# Altium schematic sheet Main.SchDoc
size B; SheetNumber: 3; SheetTotal: 3
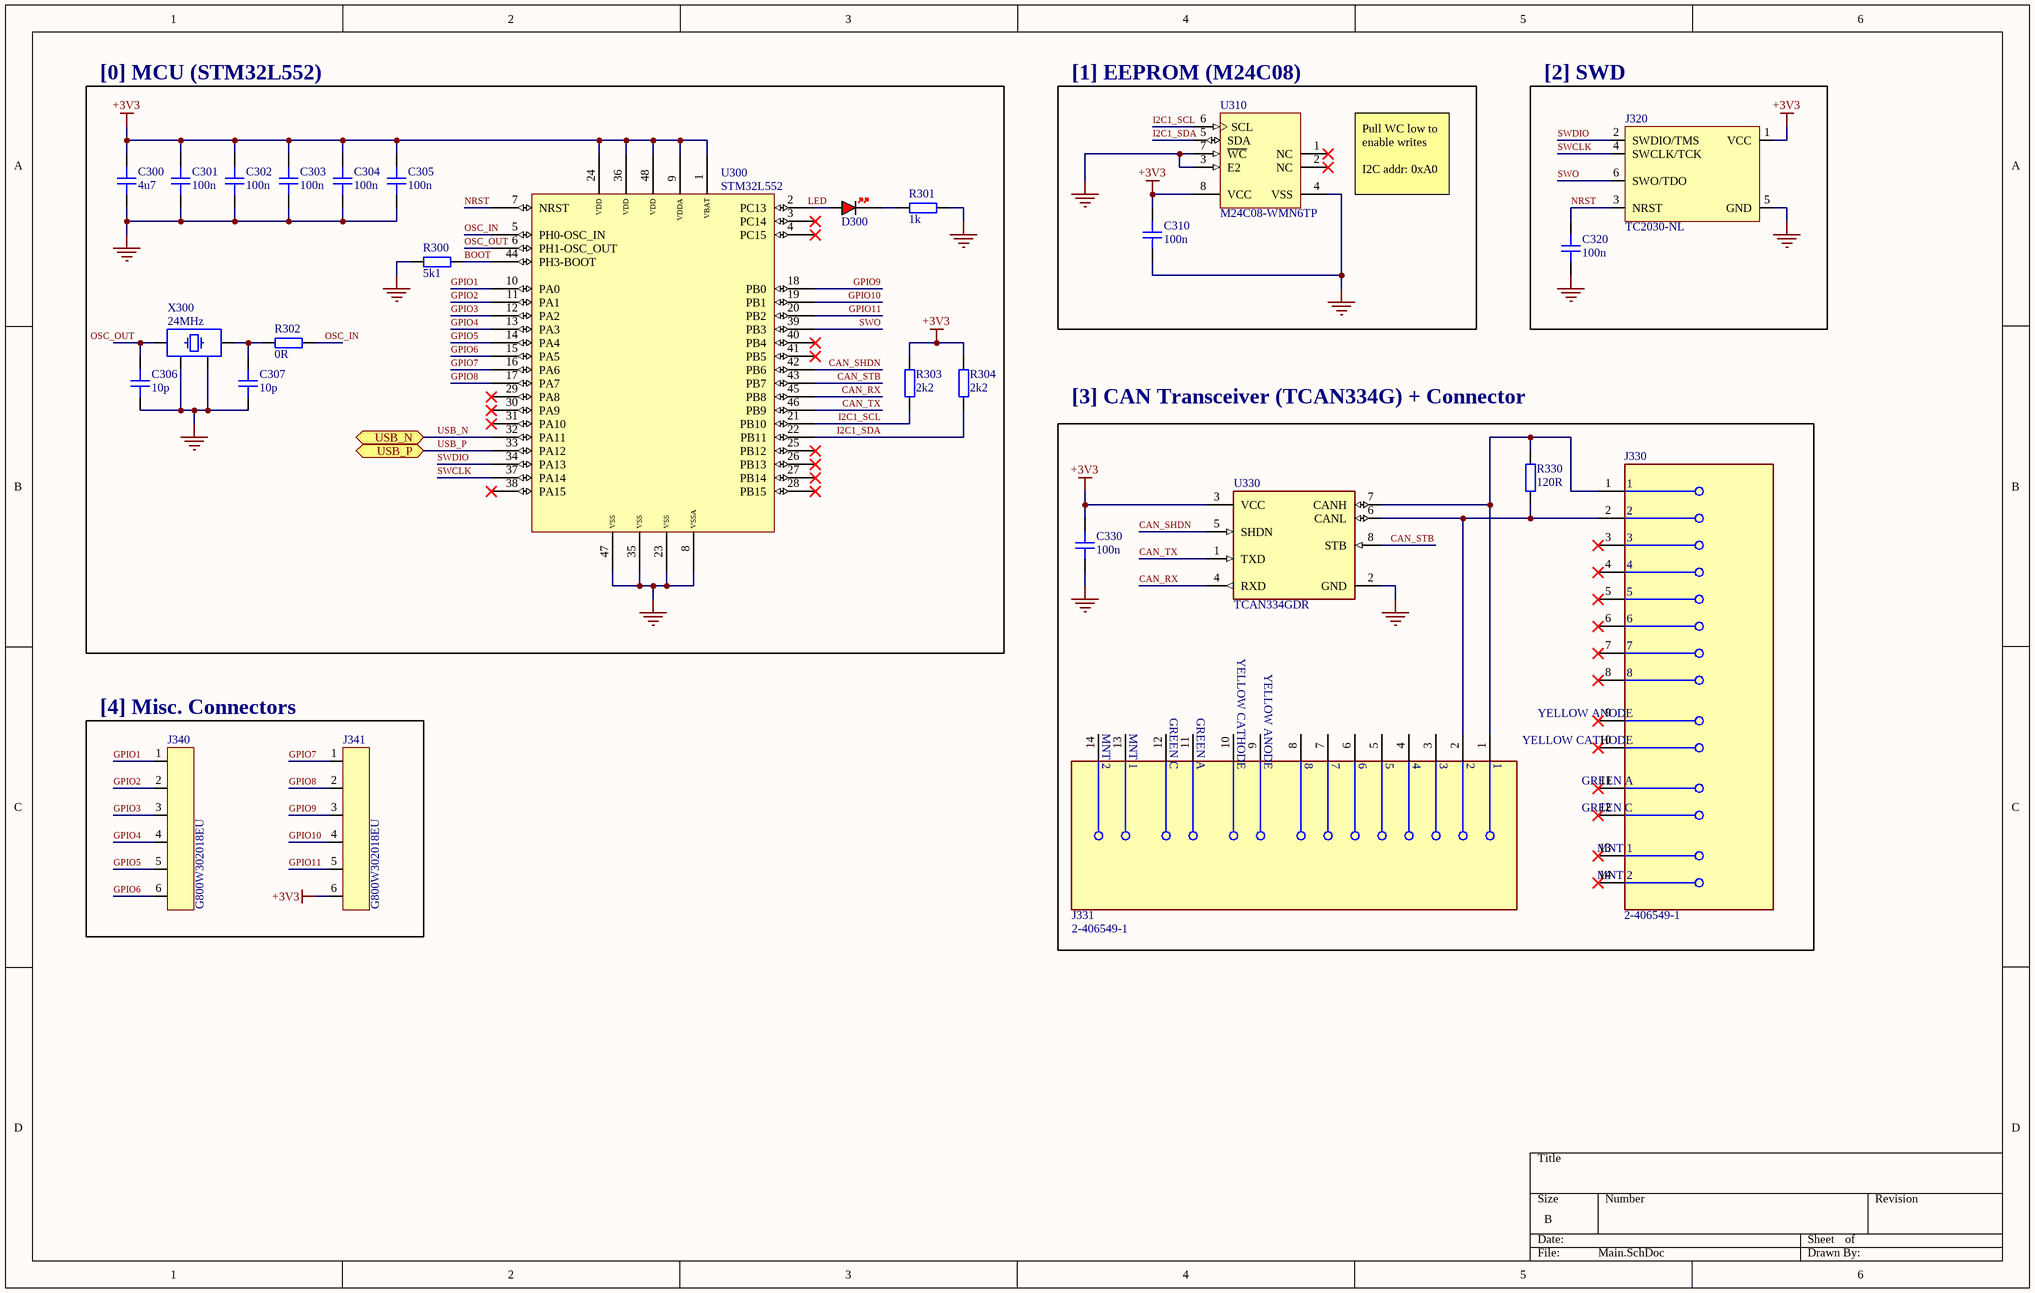
[diagram p0: Main.SchDoc]

## Parts
C300  4u7  [CAP_0805]
C301  100n  [CAP_0603]
C302  100n  [CAP_0603]
C303  100n  [CAP_0603]
C304  100n  [CAP_0603]
C305  100n  [CAP_0603]
C306  10p  [CAP_0603]
C307  10p  [CAP_0603]
C310  100n  [CAP_0603]
C320  100n  [CAP_0603]
C330  100n  [CAP_0603]
D300  RED  [LED_0603_RED]  (value not drawn)
J320  TC2030-NL  [TC2030-NL-FP]  (no BOM)
J330  2-406549-1  [FP-2-406549-1-MFG]
J331  2-406549-1  [FP-2-406549-1-MFG]
J340  G800W302018EU  [G800W302018EU]
J341  G800W302018EU  [G800W302018EU]
R300  5k1  [RES_0603]
R301  1k  [RES_0603]
R302  0R  [RES_0603]
R303  2k2  [RES_0603]
R304  2k2  [RES_0603]
R330  120R  [RES_0603]
U300  STM32L552  [LQFP48]
U310  M24C08-WMN6TP  [STM-SOIC-8_L]
U330  TCAN334GDR  [FP-D0008A-IPC_B]
X300  24MHz  [XTAL_3225]

## Blocks framed on the sheet
[0] MCU (STM32L552): C300-C307 D300 R300-R304 U300 X300
[1] EEPROM (M24C08): C310 U310
[2] SWD: C320 J320
[3] CAN Transceiver (TCAN334G) + Connector: C330 J330 J331 R330 U330
[4] Misc. Connectors: J340 J341

## Ports
USB_N (bidir, see Overview[3B], Power[4A]), USB_P (bidir, see Overview[3B], Power[4B])

## Nets
+3V3: C300.2 C301.2 C302.2 C303.2 C304.2 C305.2 C310.1 C330.2 J320.1(VCC) J341.6 R303.2 R304.2 U300.1(VBAT) U300.9(VDDA) U300.24(VDD) U300.36(VDD) U300.48(VDD) U310.8(VCC) U330.3(VCC)
GND: C300.1 C301.1 C302.1 C303.1 C304.1 C305.1 C306.2 C307.1 C310.2 C320.1 C330.1 J320.5(GND) R300.2 R301.2 U300.8(VSSA) U300.23(VSS) U300.35(VSS) U300.47(VSS) U310.3(E2) U310.4(VSS) U310.7(~{WC}) U330.2(GND) X300.2 X300.4
BOOT: R300.1 U300.44(PH3-BOOT)
CAN_RX: U300.45(PB8) U330.4(RXD)
CAN_SHDN: U300.42(PB6) U330.5(SHDN)
CAN_STB: U300.43(PB7) U330.8(STB)
CAN_TX: U300.46(PB9) U330.1(TXD)
GPIO1: J340.1 U300.10(PA0)
GPIO2: J340.2 U300.11(PA1)
GPIO3: J340.3 U300.12(PA2)
GPIO4: J340.4 U300.13(PA3)
GPIO5: J340.5 U300.14(PA4)
GPIO6: J340.6 U300.15(PA5)
GPIO7: J341.1 U300.16(PA6)
GPIO8: J341.2 U300.17(PA7)
GPIO9: J341.3 U300.18(PB0)
GPIO10: J341.4 U300.19(PB1)
GPIO11: J341.5 U300.20(PB2)
I2C1_SCL: R303.1 U300.21(PB10) U310.6(SCL)
I2C1_SDA: R304.1 U300.22(PB11) U310.5(SDA)
LED: D300.A U300.2(PC13)
NRST: C320.2 J320.3(NRST) U300.7(NRST)
OSC_IN: R302.1 U300.5(PH0-OSC_IN)
OSC_OUT: C306.1 U300.6(PH1-OSC_OUT) X300.1
SWCLK: J320.4(SWCLK/TCK) U300.37(PA14)
SWDIO: J320.2(SWDIO/TMS) U300.34(PA13)
SWO: J320.6(SWO/TDO) U300.39(PB3)
USB_N: U300.32(PA11) ; port USB_N
USB_P: U300.33(PA12) ; port USB_P
NetC307_2: C307.2 R302.2 X300.3
NetD300_K: D300.K R301.1
NetJ330_1: J330.1 J331.1 R330.2 U330.7(CANH)
NetJ330_2: J330.2 J331.2 R330.1 U330.6(CANL)

Not connected (* = marked no-connect by the designer): J330 3* 4* 5* 6* 7* 8* 9(YELLOW_ANODE)* 10(YELLOW_CATHODE)* 11(GREEN_A)* 12(GREEN_C)* 13(MNT_1)* 14(MNT_2)*; J331 3 4 5 6 7 8 9(YELLOW_ANODE) 10(YELLOW_CATHODE) 11(GREEN_A) 12(GREEN_C) 13(MNT_1) 14(MNT_2); U300 3(PC14)* 4(PC15)* 25(PB12)* 26(PB13)* 27(PB14)* 28(PB15)* 29(PA8)* 30(PA9)* 31(PA10)* 38(PA15)* 40(PB4)* 41(PB5)*; U310 1(NC)* 2(NC)*

## Notes on the sheet
- Pull WC low to enable writes
  I2C addr: 0xA0

## Library data of the parts
C300 = CAP_0805_16V: Capacitor SMD 0805 16V
C301-C307 C310 C320 C330 = CAP_0603_16V: Capacitor SMD 0603 16V
D300 = LED_0603_RED: LED 0603 RED SMD
J320 = TC2030-NL: Tag-Connect No-Solder SWD Debug Connector (No Legs) DO NOT PLACE; Manufacturer: Tag-Connect; Manufacturer Part Number: TC2030-NL-FP
J330 J331 = CMP-2000-05541-2: CONN MOD JACK 8P8C R/A SHIELDED; Max Voltage Rating (AC): 150V; Number of Contacts: 8; PCB Mounting Orientation: Right Angle; Direction: Up; Pitch: 2.03mm; Number of Ports: 1; Gender: Female; Tail Length: 2.54mm; Current Rating: 1.5A; Keyed: No; Approvals: UL; PCB Thickness: 1.57mm; Element Configuration: Single; Connector Type: Jack; Color: Yellow; Max Operating Temperature: 85°C; Weight: 0.144729oz; Series: -; Orientation: Right Angle; Width: 17.27mm; Package Quantity: 63; Mount: Panel; Contact Plating: Gold; Length: 17.86mm; Depth: 15.75mm; Flammability Rating: UL94 V-0; Shielding: Shielded; Housing Material: Thermoplastic; Number of Positions Loaded: 8; Contact Material: Bronze; Voltage Rating: 150V; Packaging: Tray; Number of Positions: 8; Termination: Solder; Number of Rows: 1; Radiation Hardening: No; Min Operating Temperature: -40°C; RoHS Compliant: Yes; Housing Color: Black
J340 J341 = G800W302018EU: Pin Header 6 Position 2.54mm Pitch; Manufacturer: Amphenol; Manufacturer Part Number: G800W302018EU
R300-R304 R330 = RES_0603: Resistor SMD 0603; Manufacturer: *; Manufacturer Part Number: *; Distributor Link: *
U300 = STM32L552: STM32L552 MCU LQFP-48
U310 = CMP-2000-06639-1: I2C Bus EEPROM, 8 Kbits, 2.5 to 5.5 V, -40 to 85 degC, 8-Pin SOIC, RoHS, Tape and Reel; Manufacturer: STMicroelectronics; Frequency: 0.4MHz; Access Time (Max): 900ns; Write Protection: Yes; Density: 8192Bit; Operating Supply Voltage (Min): 2.5V; Organization: 1Kx8; Rad Hardened: No; Data Retention: 40; Supply Current: 2mA; Operating Supply Voltage (Typ): 3.3/5V; Operating Supply Voltage (Max): 5.5V; Interface Type: Serial(I2C); DELETED: Compliant; Package Description: 8-Pin Small Outline Integrated Circuit, Body 4.9 x 3.9 mm, Pitch 1.27 mm; Operating Temperature Classification: Industrial; Datasheet Version: Rev. 4, 06/2014; Datasheet URL: http://www.st.com/content/ccc/resource/technical/document/datasheet/cc/f5/a5/01/6f/4b/47/d2/DM00070057.pdf/files/DM00070057.pdf/jcr:content/translations/en.DM00070057.pdf; Packaging: TapeandReel; Operating Temperature (Min): -40C; Package Type: SOICN; Operating Temp Range: -40Cto85C; Frequency (Max): 0.4MHz; Mounting Technology: SurfaceMount; Operating Temperature (Max): 85C; Manufacturer URL: http://www.st.com/; Programmable: Yes; Package Reference: SOIC-8; Mounting: SurfaceMount; Pin Count: 8
U330 = CMP-04872-000213-1: IC TRANSCEIVER 1/1 8SOIC; Receiver Hysteresis: 120mV; Data Rate: 1Mbps; Mount: Surface Mount; Lead Free: Lead Free; Max Operating Temperature: 125°C; Case/Package: SOIC; RoHS Compliant: Yes; Packaging: Tape and Reel; Min Operating Temperature: -40°C
X300 = TSX-3225_24.0000MF15X-AC: Crystal SMD 24MHz 10PPM 7pF 3225; Manufacturer: Epson; Manufacturer Number: TSX-3225 24.0000MF15X-AC; ESR: 40R; Value: 24MHz; Type: XTAL; Load Capacitance: 7pF